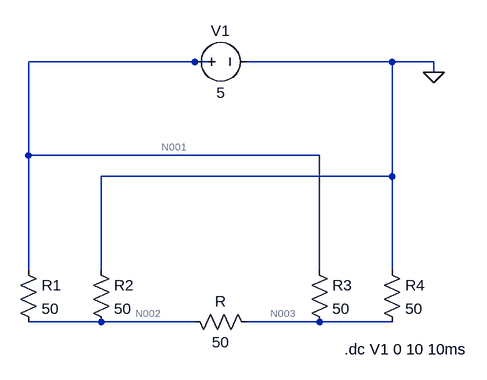
[diagram p0: schematic Draft1.asc]
Draft1.asc, the LTspice schematic file:
Version 4
SHEET 1 880 680
WIRE 176 -208 -80 -208
WIRE 208 -208 176 -208
WIRE 480 -208 256 -208
WIRE 544 -208 480 -208
WIRE 544 -192 544 -208
WIRE -80 -64 -80 -208
WIRE 368 -64 -80 -64
WIRE 480 -32 480 -208
WIRE 480 -32 32 -32
WIRE -80 112 -80 -64
WIRE 32 112 32 -32
WIRE 368 112 368 -64
WIRE 480 112 480 -32
WIRE 32 192 -80 192
WIRE 176 192 32 192
WIRE 368 192 256 192
WIRE 480 192 368 192
FLAG 544 -192 0
SYMBOL res -96 96 R0
SYMATTR InstName R1
SYMATTR Value 50
SYMBOL res 16 96 R0
SYMATTR InstName R2
SYMATTR Value 50
SYMBOL res 352 96 R0
SYMATTR InstName R3
SYMATTR Value 50
SYMBOL res 464 96 R0
SYMATTR InstName R4
SYMATTR Value 50
SYMBOL res 160 176 M90
WINDOW 0 0 56 VBottom 2
WINDOW 3 32 56 VTop 2
SYMATTR InstName R
SYMATTR Value 50
SYMBOL voltage 160 -208 R270
WINDOW 0 32 56 VTop 2
WINDOW 3 -32 56 VBottom 2
SYMATTR InstName V1
SYMATTR Value 5
TEXT 406 234 Left 2 !.dc V1 0 10 10ms

The netlist it stands for:
* Draft1.asc
R1 N001 N002 50
R2 0 N002 50
R3 N001 N003 50
R4 0 N003 50
R N002 N003 50
V1 N001 0 5
.dc V1 0 10 10ms
.backanno
.end

* Results of the author's LTspice run, read from the files saved beside the schematic
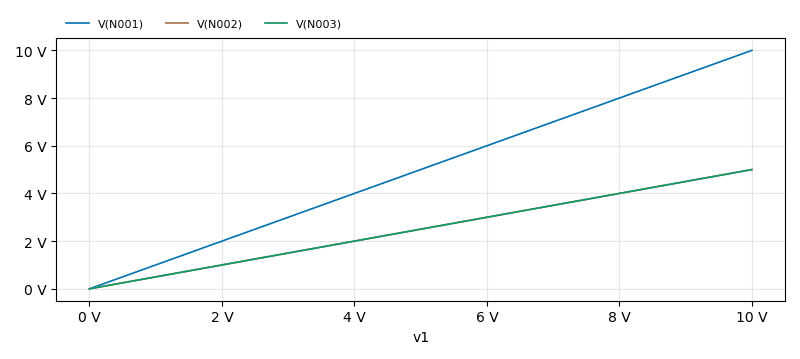
[diagram p1: DC transfer characteristic of Draft1.asc, plotted from the saved traces]
* DC transfer characteristic, 1 run:
*   V(N001): 0 V at v1=0 V, 10 V at v1=10 V, min 0 V, max 10 V
*   V(N002): 0 V at v1=0 V, 5 V at v1=10 V, min 0 V, max 5 V
*   V(N003): 0 V at v1=0 V, 5 V at v1=10 V, min 0 V, max 5 V